# EAGLE design snorlax_velostat (EAGLE 7.5.0)
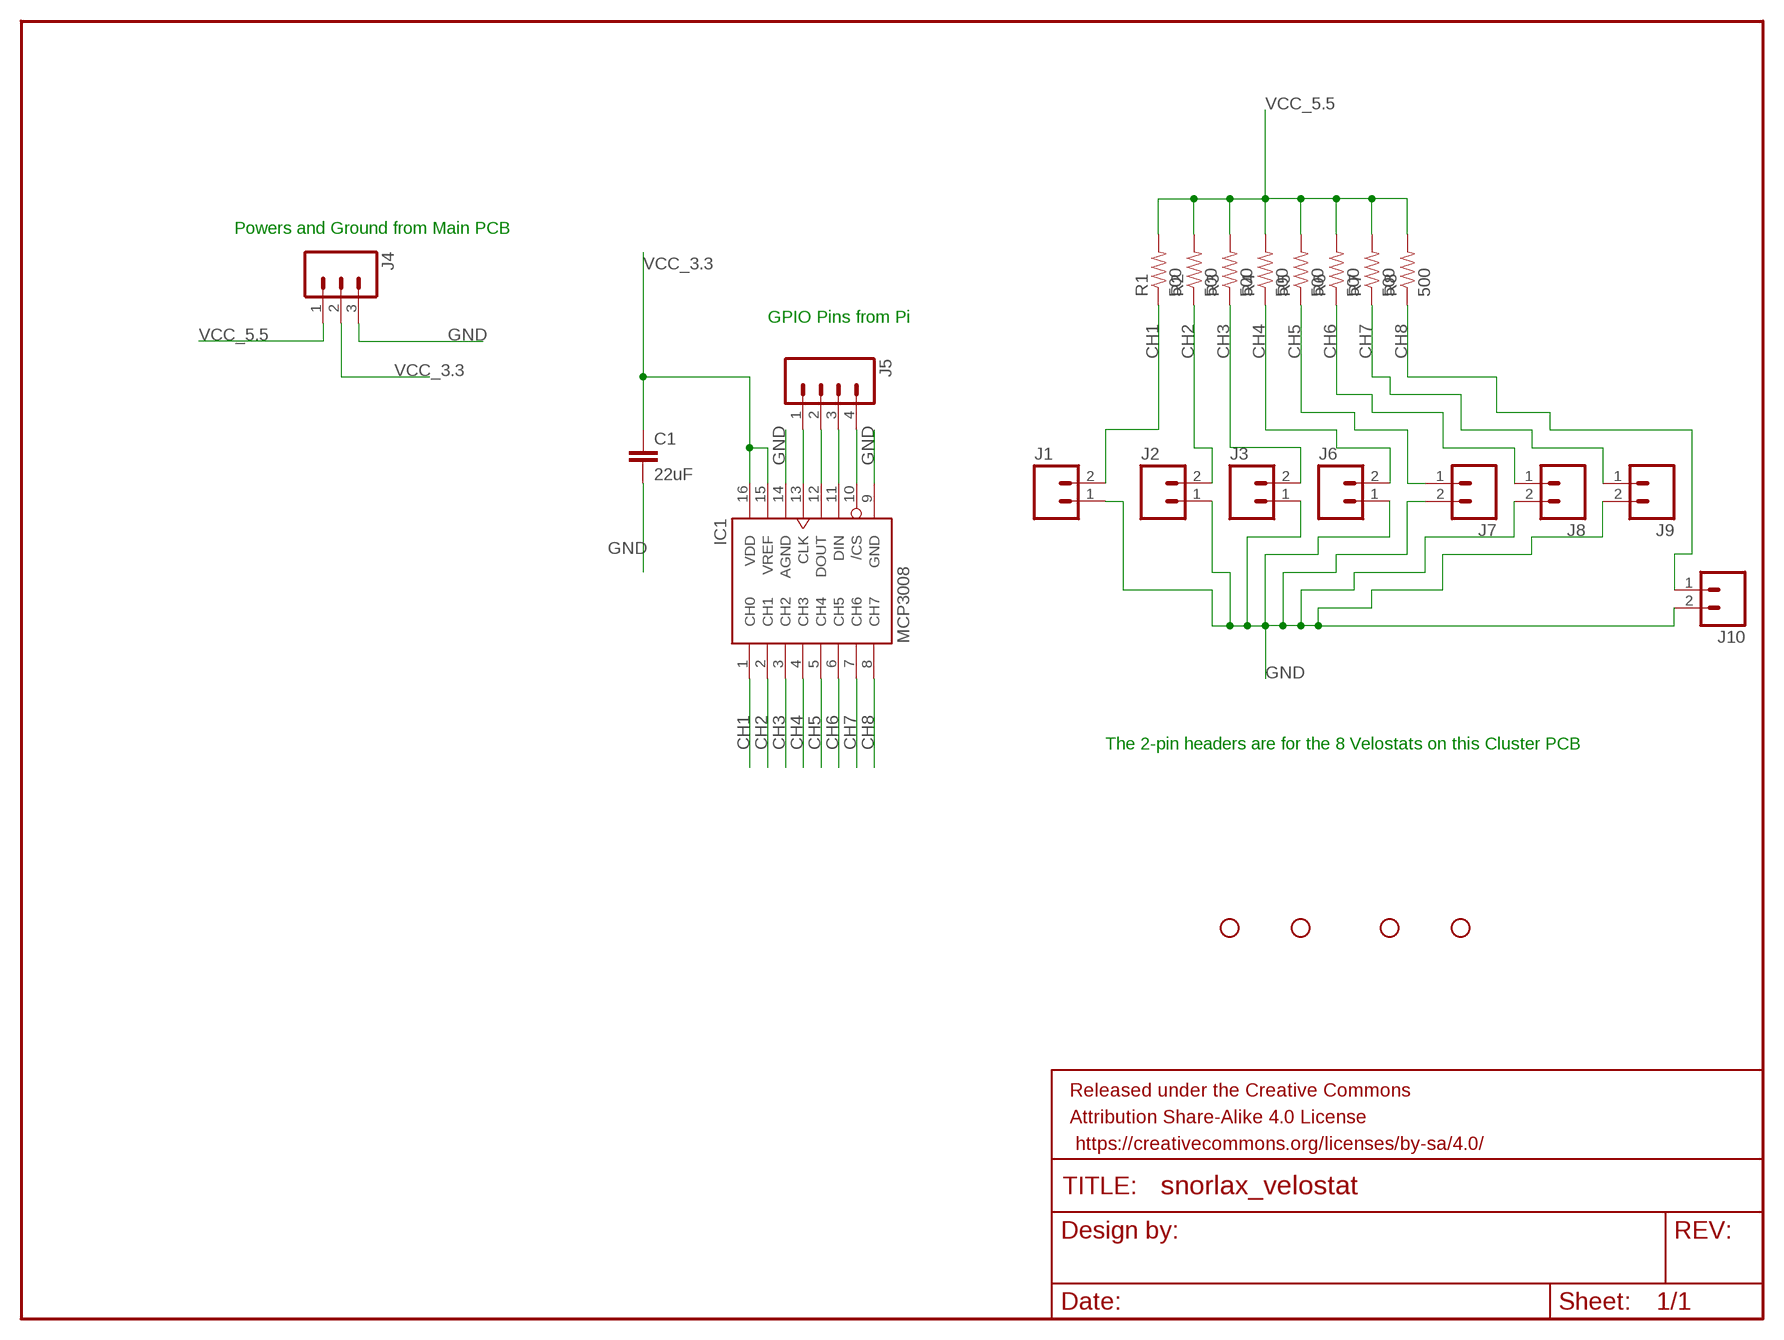
[diagram p0: schematic, sheet 1]

## Parts
C1  22uF  CAP1206  [1206]
FRAME1  FRAME-LETTER  [CREATIVE_COMMONS]
H1  STAND-OFF  [STAND-OFF]
H2  STAND-OFF  [STAND-OFF]
H3  STAND-OFF  [STAND-OFF]
H4  STAND-OFF  [STAND-OFF]
IC1  MCP3008  [DIL16]
J1  M02LOCK  [1X02_LOCK]
J2  M02LOCK  [1X02_LOCK]
J3  M02LOCK  [1X02_LOCK]
J4  M03LOCK  [1X03_LOCK]
J5  M04LOCK  [1X04_LOCK]
J6  M02LOCK  [1X02_LOCK]
J7  M02LOCK  [1X02_LOCK]
J8  M02LOCK  [1X02_LOCK]
J9  M02LOCK  [1X02_LOCK]
J10  M02LOCK  [1X02_LOCK]
R1  500  RESISTOR1206  [1206]
R2  500  RESISTOR1206  [1206]
R3  500  RESISTOR1206  [1206]
R4  500  RESISTOR1206  [1206]
R5  500  RESISTOR1206  [1206]
R6  500  RESISTOR1206  [1206]
R7  500  RESISTOR1206  [1206]
R8  500  RESISTOR1206  [1206]

## Nets
CH1: IC1.1(CH0) J1.2 R1.1
CH2: IC1.2(CH1) J2.2 R2.1
CH3: IC1.3(CH2) J3.2 R3.1
CH4: IC1.4(CH3) J6.2 R4.1
CH5: IC1.5(CH4) J7.1 R5.1
CH6: IC1.6(CH5) J8.1 R6.1
CH7: IC1.7(CH6) J9.1 R7.1
CH8: IC1.8(CH7) J10.1 R8.1
GND: C1.2 IC1.9(GND) IC1.14(AGND) J1.1 J2.1 J3.1 J4.3 J6.1 J7.2 J8.2 J9.2 J10.2
N$12: IC1.13(CLK) J5.1
N$13: IC1.12(DOUT) J5.2
N$14: IC1.11(DIN) J5.3
N$15: IC1.10(/CS) J5.4
VCC_3.3: C1.1 IC1.15(VREF) IC1.16(VDD) J4.2
VCC_5.5: J4.1 R1.2 R2.2 R3.2 R4.2 R5.2 R6.2 R7.2 R8.2

## Notes on the sheet
- Powers and Ground from Main PCB
- GPIO Pins from Pi
- The 2-pin headers are for the 8 Velostats on this Cluster PCB

## Library data of the parts
C1 = SparkFun-Capacitors:CAP: Capacitor Standard 0603 ceramic capacitor, and 0.1" leaded capacitor.
FRAME1 = SparkFun-Aesthetics:FRAME-LETTER: Schematic Frame Standard 8.5x11 US Letter frame
H1-H4 = SparkFun-Electromechanical:STAND-OFF: #4 Stand Off This is the mechanical footprint for a #4 phillips button head screw. Use the keepout ring to avoid running the screw head into surrounding components. SKU : PRT-00447
IC1 = adafruit:MCP3008
J1-J3 J6-J10 = SparkFun-Connectors:M02: Standard 2-pin 0.1" header. Use with - straight break away headers ( PRT-00116) - right angle break away headers (PRT-00553) - swiss pins (PRT-00743) - machine pins (PRT-00117) - female headers (PRT-00115) Molex polarized connector foot print use with: PRT-08233 with associated crimp pins and housings. 2.54_SCREWTERM for use with PRT-10571. 3.5mm Screw Terminal footprints for PRT-08084 5mm Screw Terminal footprints for use with PRT-08432
J4 = SparkFun-Connectors:M03: Header 3 Standard 3-pin 0.1" header. Use with straight break away headers (SKU : PRT-00116), right angle break away headers (PRT-00553), swiss pins (PRT-00743), machine pins (PRT-00117), and female headers (PRT-00115). Molex polarized connector foot print use with SKU : PRT-08232 with associated crimp pins and housings.
J5 = SparkFun-Connectors:M04: Header 4 Standard 4-pin 0.1" header. Use with straight break away headers (SKU : PRT-00116), right angle break away headers (PRT-00553), swiss pins (PRT-00743), machine pins (PRT-00117), and female headers (PRT-00115). Molex polarized connector foot print use with SKU : PRT-08231 with associated crimp pins and housings. 1MM SMD Version SKU: PRT-10208; PROD_ID: CONN-09696
R1-R8 = SparkFun-Resistors:RESISTOR: Resistor Basic schematic elements and footprints for 0603, 1206, and PTH resistors.

## Board
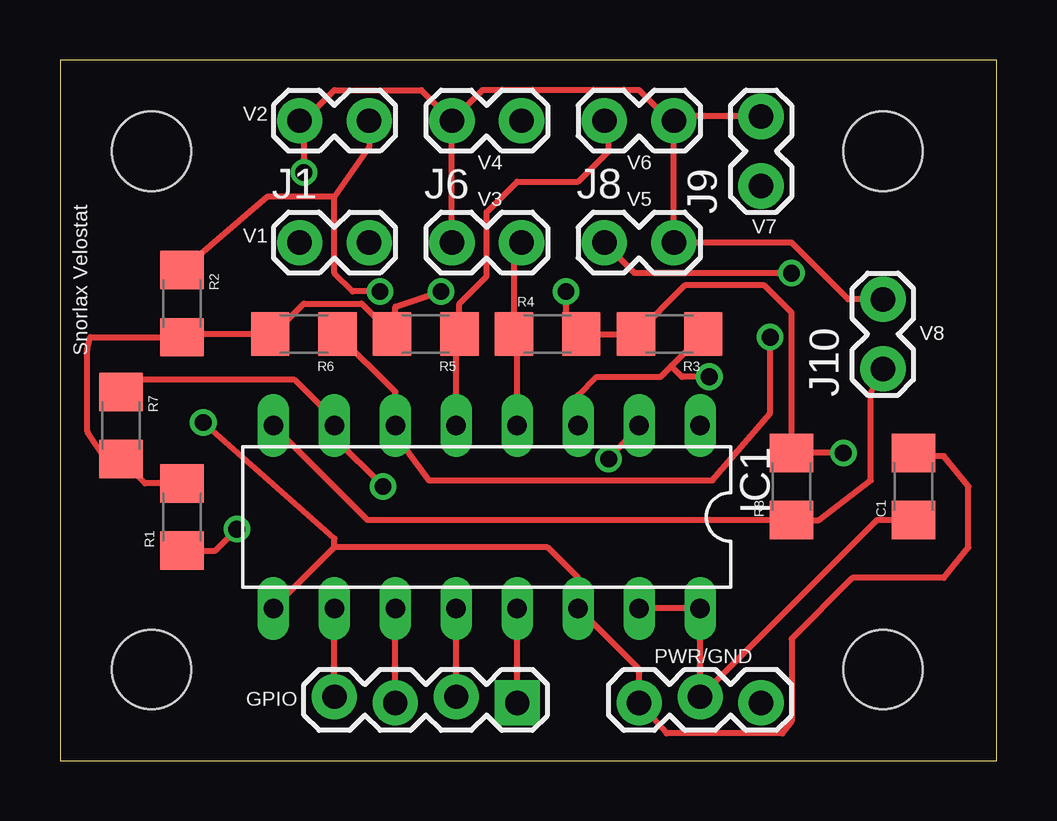
[diagram p1: board, top side]
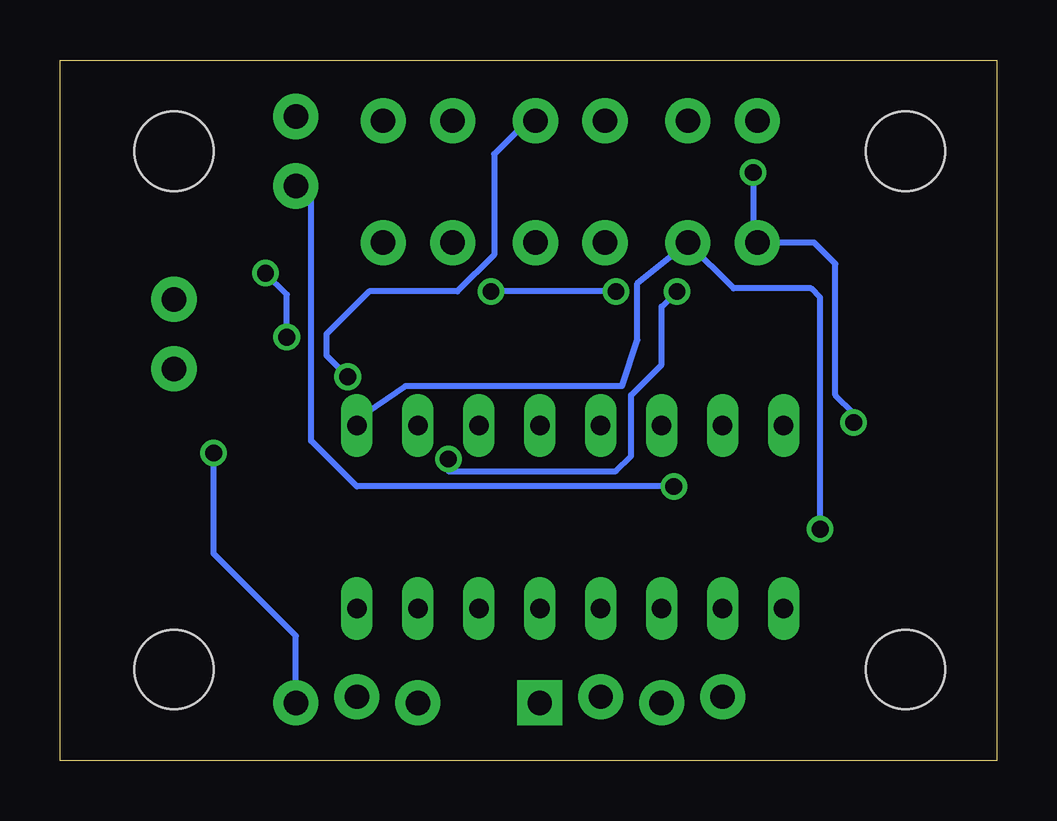
[diagram p2: board, bottom side, seen from below]

Size 39.04 x 29.2 mm. Coordinates in mm from the lower left corner, seen from the top.
Outline: 0,0 39.04,0 39.04,29.2 0,29.2 0,0
Copper layers (1*16): Top 0.035mm / dielectric 1.5mm / Bottom 0.035mm
Design rules "default": minimum track width 10mil, minimum drill 24mil, track to track 8mil, track to pad 8mil, pad to pad 8mil, via to via 8mil, smd to smd 8mil, copper to edge 40mil, drill to drill 8mil, minimum pad ring 10mil, minimum via ring 8mil, stop-mask expansion 4mil, vias tented up to drill 0mil, thermal gap 10mil

### Footprints (pad centres in the part's own frame; a part is rotated, then mirrored left to right if it is on the bottom)
1206 = smd 1.6 x 1.8: 1 -1.4,0; 2 1.4,0
STAND-OFF = hole 3.302: 0,0
DIL16 = drill 0.813 long: 1 -8.89,-3.81; 2 -6.35,-3.81; 3 -3.81,-3.81; 4 -1.27,-3.81; 5 1.27,-3.81; 6 3.81,-3.81; 7 6.35,-3.81; 8 8.89,-3.81; 9 8.89,3.81; 10 6.35,3.81; 11 3.81,3.81; 12 1.27,3.81; 13 -1.27,3.81; 14 -3.81,3.81; 15 -6.35,3.81; 16 -8.89,3.81
1X02_LOCK = drill 1.016 pad 1.88: 1 -0.178,0; 2 2.718,0
1X03_LOCK = drill 1.016 pad 1.88: 1 0,0.127; 2 2.54,-0.127; 3 5.08,0.127
1X04_LOCK = drill 1.016 pad 1.88 square: 1 0,0.127 | drill 1.016 pad 1.88: 2 2.54,-0.127; 3 5.08,0.127; 4 7.62,-0.127

### Placement (x,y rotation side)
C1  35.56,11.43 90 top
FRAME1  -101.6,1.27 0 top  (outside the outline)
H1  34.29,3.81 0 top
H2  34.29,25.4 0 top
H3  3.81,3.81 0 top
H4  3.81,25.4 0 top
IC1  17.78,10.16 180 top
J1  10.16,21.59 0 top
J2  10.16,26.67 0 top
J3  16.51,26.67 0 top
J4  29.21,2.54 180 top
J5  19.05,2.54 180 top
J6  16.51,21.59 0 top
J7  22.86,26.67 0 top
J8  22.86,21.59 0 top
J9  29.21,24.13 90 top
J10  34.29,16.51 90 top
R1  5.08,10.16 90 top
R2  5.08,19.05 270 top
R3  25.4,17.78 180 top
R4  20.32,17.78 0 top
R5  15.24,17.78 180 top
R6  10.16,17.78 180 top
R7  2.54,13.97 270 top
R8  30.48,11.43 90 top

### Tracks (layer width: path | path; a pad name or v marks a point on that pad's centre or on a via)
CH1  (via drill 0.7)
  Top 0.254: R1.1 6.47,8.76 v7.37,9.65
  Bottom 0.254: IC1.1 26.67,14.22 24.64,15.62 15.62,15.62 14.99,17.53 14.99,19.89 J1.2 10.97,19.68 7.75,19.68 7.37,19.3 v7.37,9.65
CH2  (via drill 0.7)
  Top 0.254: J2.2 12.88,25.58 11.43,23.5 | 11.43,23.5 8.63,23.5 R2.1 | IC1.2 v22.86,12.57 | v13.34,19.56 12.19,19.56 11.43,20.32 11.43,23.5
  Bottom 0.254: v13.34,19.56 13.97,18.92 13.97,16.51 15.24,15.24 15.24,12.7 15.88,12.06 22.86,12.06 v22.86,12.57
CH3  (via drill 0.7)
  Top 0.254: IC1.3 21.59,15.24 22.35,16 25.02,16 25.46,16.45 | 25.46,16.45 R3.1 | v27.05,16 25.91,16 25.46,16.45
  Bottom 0.254: J3.2 19.56,26.67 20.95,25.27 20.95,21.08 22.48,19.56 26.16,19.56 27.94,17.78 27.94,16.89 v27.05,16
CH4
  Top 0.254: IC1.4 19.05,17.65 R4.1 18.92,21.28 J6.2
CH5
  Top 0.254: IC1.5 16.51,17.65 R5.1 16.64,19.05 17.78,20.19 17.78,22.86 19.05,24.13 21.59,24.13 22.86,25.4 22.86,26.49 J7.1
CH6  (via drill 0.7)
  Top 0.254: R6.1 13.97,15.37 IC1.6 13.97,13.59 15.37,11.68 27.18,11.68 29.59,14.48 v29.59,17.65 | v30.48,20.32 23.95,20.32 J8.1
  Bottom 0.254: v29.59,17.65 29.59,19.43 v30.48,20.32
CH7  (via drill 0.7)
  Top 0.254: R7.1 3.04,15.88 9.78,15.88 11.43,14.22 IC1.7 11.43,13.46 v13.46,11.43
  Bottom 0.254: v13.46,11.43 26.67,11.43 28.57,13.34 28.57,23.32 J9.1
CH8
  Top 0.254: IC1.8 12.83,10.03 R8.1 31.62,10.03 33.78,11.68 33.78,15.32 J10.1
GND  (via drill 0.7)
  Top 0.254: 11.43,8.89 20.32,8.89 21.59,7.62 IC1.14 24.13,3.81 J4.3 25.27,1.14 30.1,1.14 30.48,1.65 30.48,5.08 33.02,7.62 36.83,7.62 37.85,8.89 37.85,11.43 36.83,12.7 35.69,12.7 C1.2 | 11.43,8.89 IC1.9 | J10.2 32.84,19.23 30.48,21.59 J8.2 J7.2 | J9.2 25.76,26.85 J7.2 | J7.2 25.4,26.67 24.13,27.94 17.6,27.94 J3.1 | J2.1 10.16,26.67 | 10.16,26.67 11.43,27.94 15.06,27.94 J3.1 | 10.16,26.67 v10.16,24.51 | 11.43,8.89 11.43,9.27 v5.97,14.1 | J6.1 J3.1
  Bottom 0.254: v10.16,24.51 10.16,21.77 J1.1 7.62,21.59 6.73,20.7 6.73,15.24 5.97,14.48 v5.97,14.1
N$12
  Top 0.254: J5.1 IC1.13
N$13
  Top 0.254: J5.2 IC1.12
N$14
  Top 0.254: J5.3 IC1.11
N$15
  Top 0.254: J5.4 IC1.10
VCC_3.3
  Top 0.254: IC1.15 IC1.16 J4.2 34.03,10.03 C1.1
VCC_5.5  (via drill 0.7)
  Top 0.254: R1.2 3.55,11.56 R7.2 1.91,12.57 1.14,13.72 1.14,17.14 1.27,17.65 R2.2 5.21,17.78 R6.2 8.89,17.78 10.16,19.05 12.57,19.05 R5.2 13.97,17.78 13.97,18.92 v15.88,19.56 | v32.64,12.83 R8.2 30.48,18.67 29.34,19.81 26.03,19.81 R3.2 R4.2 21.08,18.42 v21.08,19.56
  Bottom 0.254: J4.1 29.21,5.21 32.64,8.64 v32.64,12.83 | v15.88,19.56 v21.08,19.56

### Text on the board
tPlace: V2 | V4 | V6 | V3 | V5 | V1 | V7 | V8 | Snorlax Velostat | PWR/GND | GPIO